# EAGLE design PATA Breakout 2 (EAGLE 9.3.1)
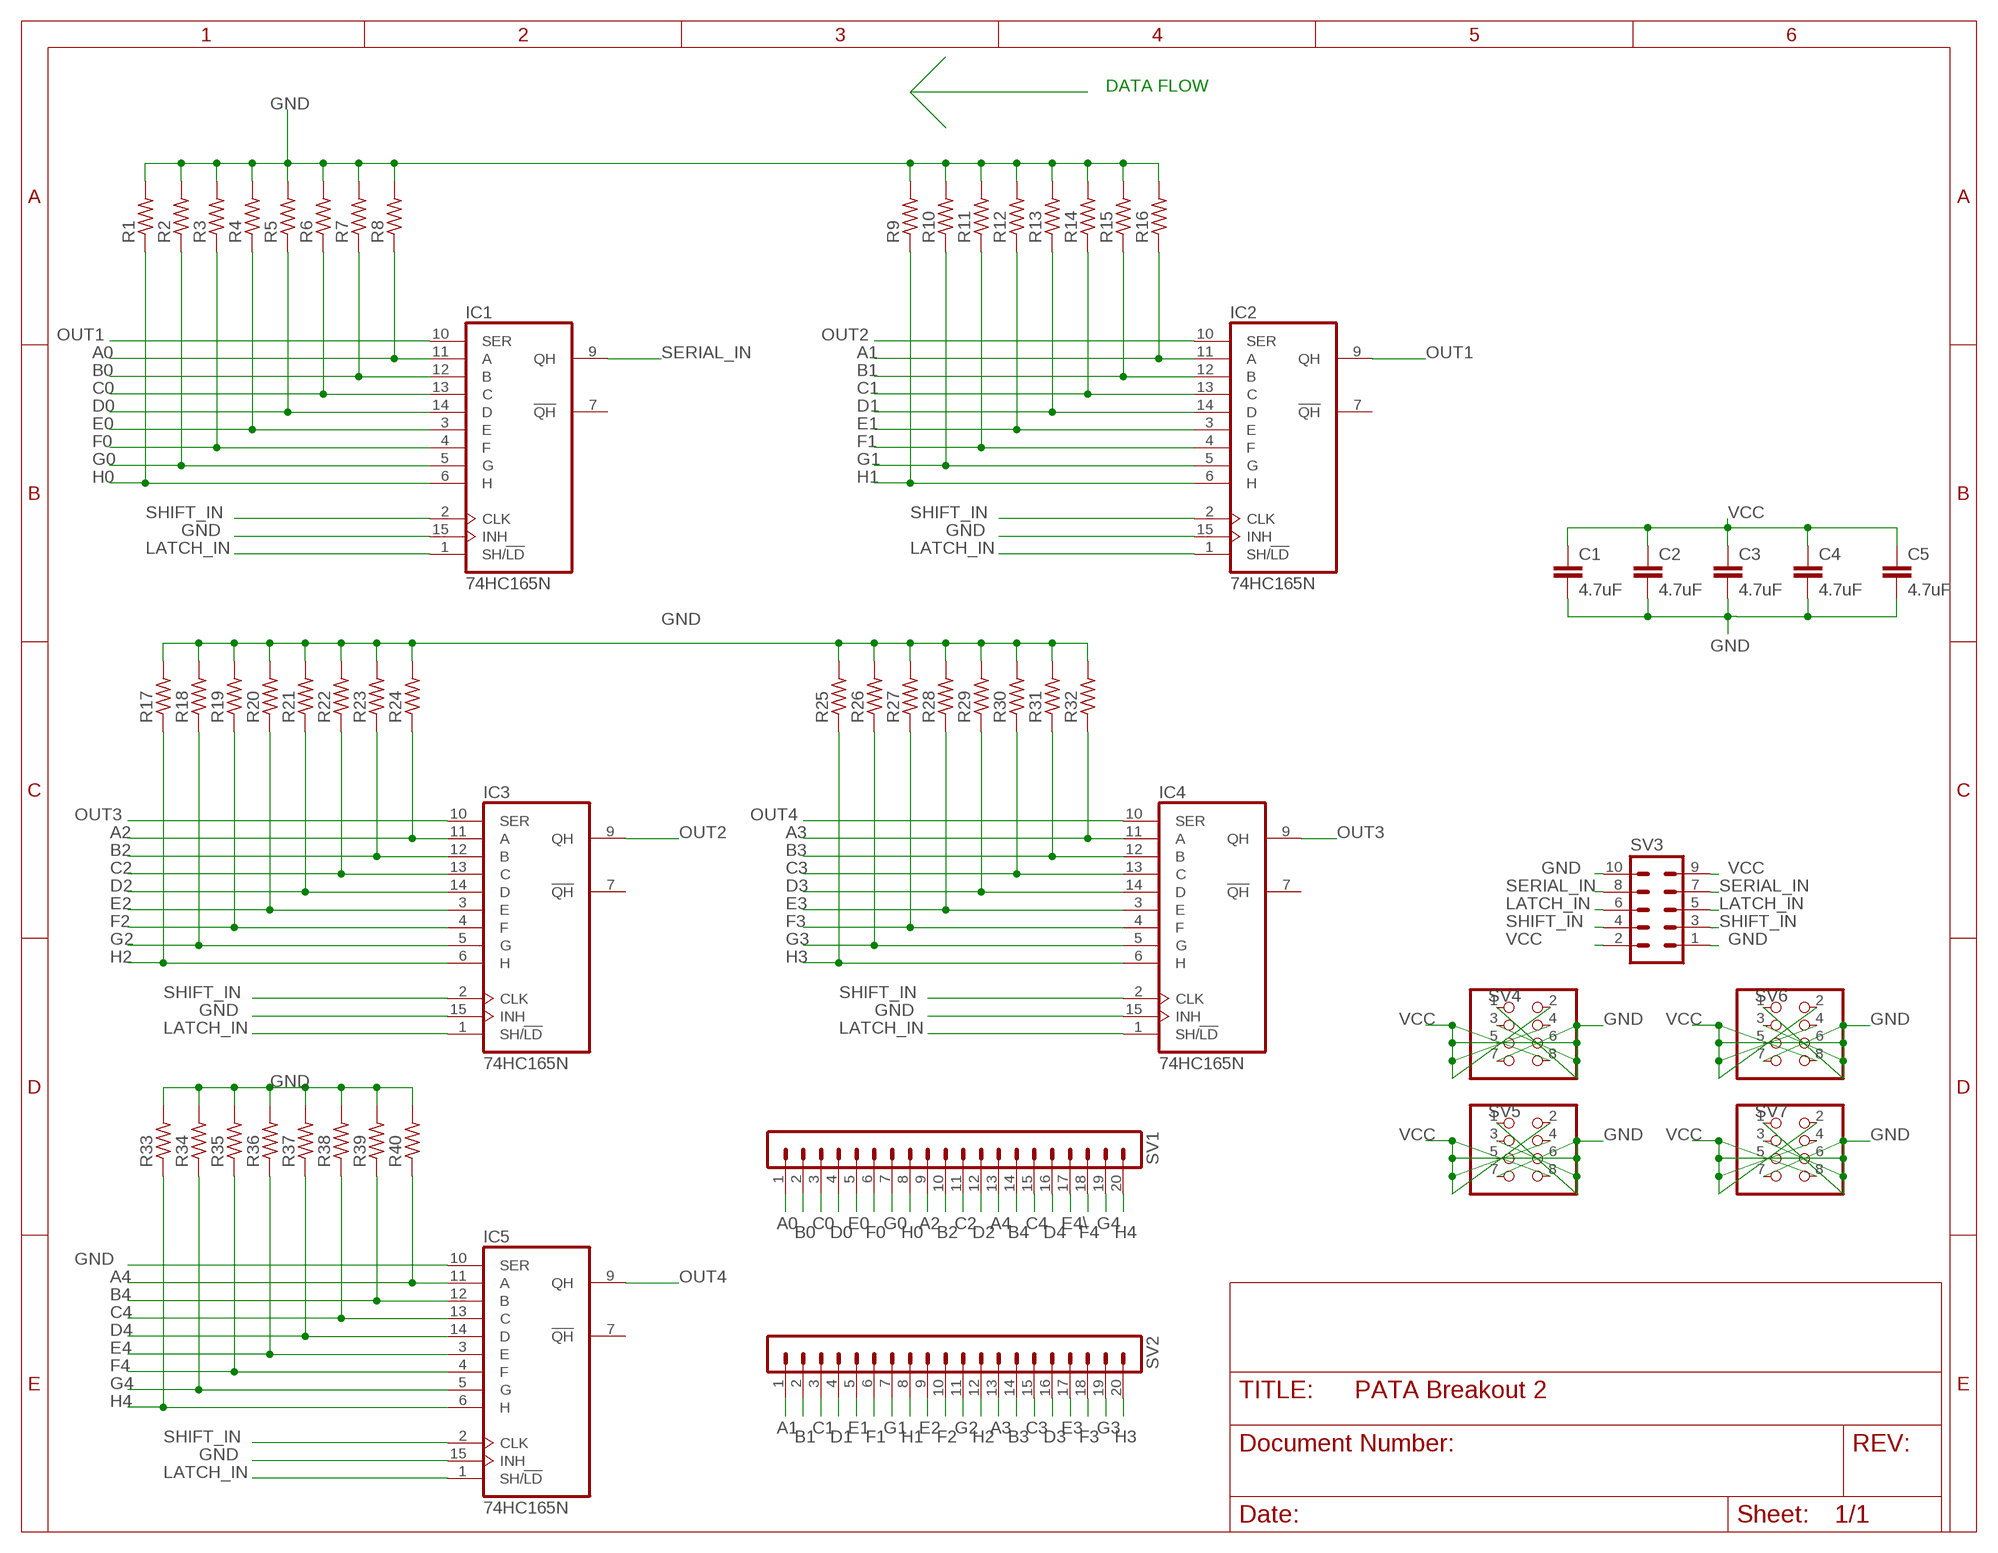
[diagram p0: schematic, sheet 1]

## Parts
C1  4.7uF  C-EU050-024X044  [C050-024X044]
C2  4.7uF  C-EU050-024X044  [C050-024X044]
C3  4.7uF  C-EU050-024X044  [C050-024X044]
C4  4.7uF  C-EU050-024X044  [C050-024X044]
C5  4.7uF  C-EU050-024X044  [C050-024X044]
IC1  74HC165N  [DIL16]
IC2  74HC165N  [DIL16]
IC3  74HC165N  [DIL16]
IC4  74HC165N  [DIL16]
IC5  74HC165N  [DIL16]
R1  R-US_0204/5  [0204/5]
R2  R-US_0204/5  [0204/5]
R3  R-US_0204/5  [0204/5]
R4  R-US_0204/5  [0204/5]
R5  R-US_0204/5  [0204/5]
R6  R-US_0204/5  [0204/5]
R7  R-US_0204/5  [0204/5]
R8  R-US_0204/5  [0204/5]
R9  R-US_0204/5  [0204/5]
R10  R-US_0204/5  [0204/5]
R11  R-US_0204/5  [0204/5]
R12  R-US_0204/5  [0204/5]
R13  R-US_0204/5  [0204/5]
R14  R-US_0204/5  [0204/5]
R15  R-US_0204/5  [0204/5]
R16  R-US_0204/5  [0204/5]
R17  R-US_0204/5  [0204/5]
R18  R-US_0204/5  [0204/5]
R19  R-US_0204/5  [0204/5]
R20  R-US_0204/5  [0204/5]
R21  R-US_0204/5  [0204/5]
R22  R-US_0204/5  [0204/5]
R23  R-US_0204/5  [0204/5]
R24  R-US_0204/5  [0204/5]
R25  R-US_0204/5  [0204/5]
R26  R-US_0204/5  [0204/5]
R27  R-US_0204/5  [0204/5]
R28  R-US_0204/5  [0204/5]
R29  R-US_0204/5  [0204/5]
R30  R-US_0204/5  [0204/5]
R31  R-US_0204/5  [0204/5]
R32  R-US_0204/5  [0204/5]
R33  R-US_0204/5  [0204/5]
R34  R-US_0204/5  [0204/5]
R35  R-US_0204/5  [0204/5]
R36  R-US_0204/5  [0204/5]
R37  R-US_0204/5  [0204/5]
R38  R-US_0204/5  [0204/5]
R39  R-US_0204/5  [0204/5]
R40  R-US_0204/5  [0204/5]
SV1  MA20-1  [MA20-1]
SV2  MA20-1  [MA20-1]
SV3  MA05-2  [MA05-2]
SV4  PINHD-2X4  [2X04]
SV5  PINHD-2X4  [2X04]
SV6  PINHD-2X4  [2X04]
SV7  PINHD-2X4  [2X04]

## Nets
A0: IC1.11(A) R8.1 SV1.1
A1: IC2.11(A) R16.1 SV2.1
A2: IC3.11(A) R24.1 SV1.9
A3: IC4.11(A) R32.1 SV2.13
A4: IC5.11(A) R40.1 SV1.13
B0: IC1.12(B) R7.1 SV1.2
B1: IC2.12(B) R15.1 SV2.2
B2: IC3.12(B) R23.1 SV1.10
B3: IC4.12(B) R31.1 SV2.14
B4: IC5.12(B) R39.1 SV1.14
C0: IC1.13(C) R6.1 SV1.3
C1: IC2.13(C) R14.1 SV2.3
C2: IC3.13(C) R22.1 SV1.11
C3: IC4.13(C) R30.1 SV2.15
C4: IC5.13(C) R38.1 SV1.15
D0: IC1.14(D) R5.1 SV1.4
D1: IC2.14(D) R13.1 SV2.4
D2: IC3.14(D) R21.1 SV1.12
D3: IC4.14(D) R29.1 SV2.16
D4: IC5.14(D) R37.1 SV1.16
E0: IC1.3(E) R4.1 SV1.5
E1: IC2.3(E) R12.1 SV2.5
E2: IC3.3(E) R20.1 SV2.9
E3: IC4.3(E) R28.1 SV2.17
E4: IC5.3(E) R36.1
E4\: SV1.17
F0: IC1.4(F) R3.1 SV1.6
F1: IC2.4(F) R11.1 SV2.6
F2: IC3.4(F) R19.1 SV2.10
F3: IC4.4(F) R27.1 SV2.18
F4: IC5.4(F) R35.1 SV1.18
G0: IC1.5(G) R2.1 SV1.7
G1: IC2.5(G) R10.1 SV2.7
G2: IC3.5(G) R18.1 SV2.11
G3: IC4.5(G) R26.1 SV2.19
G4: IC5.5(G) R34.1 SV1.19
GND: C1.2 C2.2 C3.2 C4.2 C5.2 IC1.15(INH) IC2.15(INH) IC3.15(INH) IC4.15(INH) IC5.10(SER) IC5.15(INH) R1.2 R2.2 R3.2 R4.2 R5.2 R6.2 R7.2 R8.2 R9.2 R10.2 R11.2 R12.2 R13.2 R14.2 R15.2 R16.2 R17.2 R18.2 R19.2 R20.2 R21.2 R22.2 R23.2 R24.2 R25.2 R26.2 R27.2 R28.2 R29.2 R30.2 R31.2 R32.2 R33.2 R34.2 R35.2 R36.2 R37.2 R38.2 R39.2 R40.2 SV3.1 SV3.10 SV4.1 SV4.3 SV4.5 SV4.7 SV5.1 SV5.3 SV5.5 SV5.7 SV6.1 SV6.3 SV6.5 SV6.7 SV7.1 SV7.3 SV7.5 SV7.7
H0: IC1.6(H) R1.1 SV1.8
H1: IC2.6(H) R9.1 SV2.8
H2: IC3.6(H) R17.1 SV2.12
H3: IC4.6(H) R25.1 SV2.20
H4: IC5.6(H) R33.1 SV1.20
LATCH_IN: IC1.1(SH/!LD) IC2.1(SH/!LD) IC3.1(SH/!LD) IC4.1(SH/!LD) IC5.1(SH/!LD) SV3.5 SV3.6
OUT1: IC1.10(SER) IC2.9(QH)
OUT2: IC2.10(SER) IC3.9(QH)
OUT3: IC3.10(SER) IC4.9(QH)
OUT4: IC4.10(SER) IC5.9(QH)
SERIAL_IN: IC1.9(QH) SV3.7 SV3.8
SHIFT_IN: IC1.2(CLK) IC2.2(CLK) IC3.2(CLK) IC4.2(CLK) IC5.2(CLK) SV3.3 SV3.4
VCC: C1.1 C2.1 C3.1 C4.1 C5.1 SV3.2 SV3.9 SV4.2 SV4.4 SV4.6 SV4.8 SV5.2 SV5.4 SV5.6 SV5.8 SV6.2 SV6.4 SV6.6 SV6.8 SV7.2 SV7.4 SV7.6 SV7.8
Unconnected: IC1.7(!QH) IC2.7(!QH) IC3.7(!QH) IC4.7(!QH) IC5.7(!QH)

## Notes on the sheet
- DATA FLOW

## Power pins joined to a net without a drawn wire
GND: IC1.8(GND) IC2.8(GND) IC3.8(GND) IC4.8(GND) IC5.8(GND)
VCC: IC1.16(VCC) IC2.16(VCC) IC3.16(VCC) IC4.16(VCC) IC5.16(VCC)

## Library data of the parts
C1-C5 = rcl:C-EU: CAPACITOR, European symbol; SPICEPREFIX: C
IC1-IC5 = 74xx-eu:74*165: 8-bit parallel load SHIFT REGISTER
R1-R40 = rcl:R-US_: RESISTOR, American symbol; SPICEPREFIX: R
SV1 SV2 = con-lstb:MA20-1: PIN HEADER; OC_FARNELL: unknown; OC_NEWARK: unknown
SV3 = con-lstb:MA05-2: PIN HEADER; OC_FARNELL: unknown; OC_NEWARK: unknown
SV4-SV7 = pinhead:PINHD-2X4: PIN HEADER

## Board
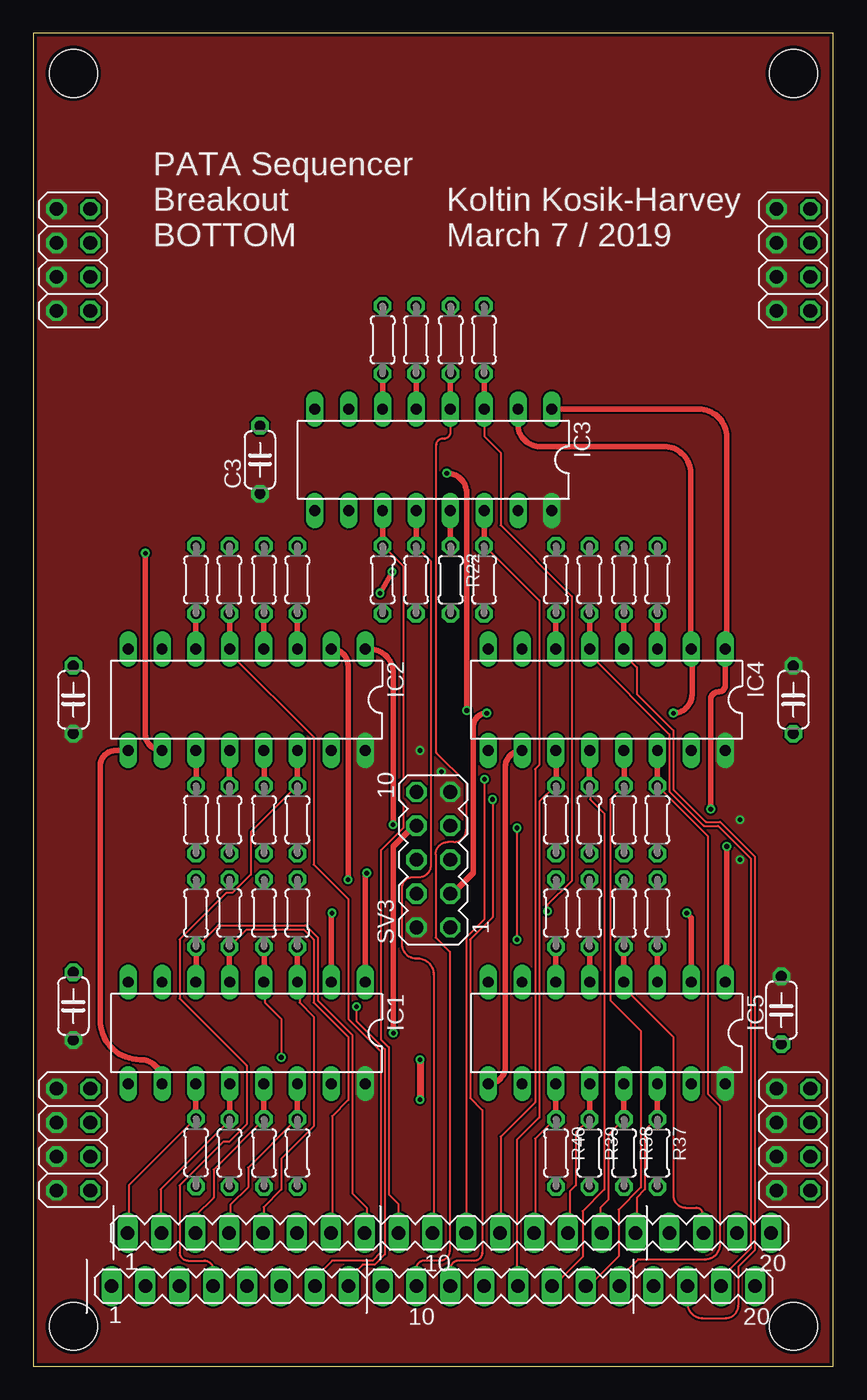
[diagram p1: board, top side]
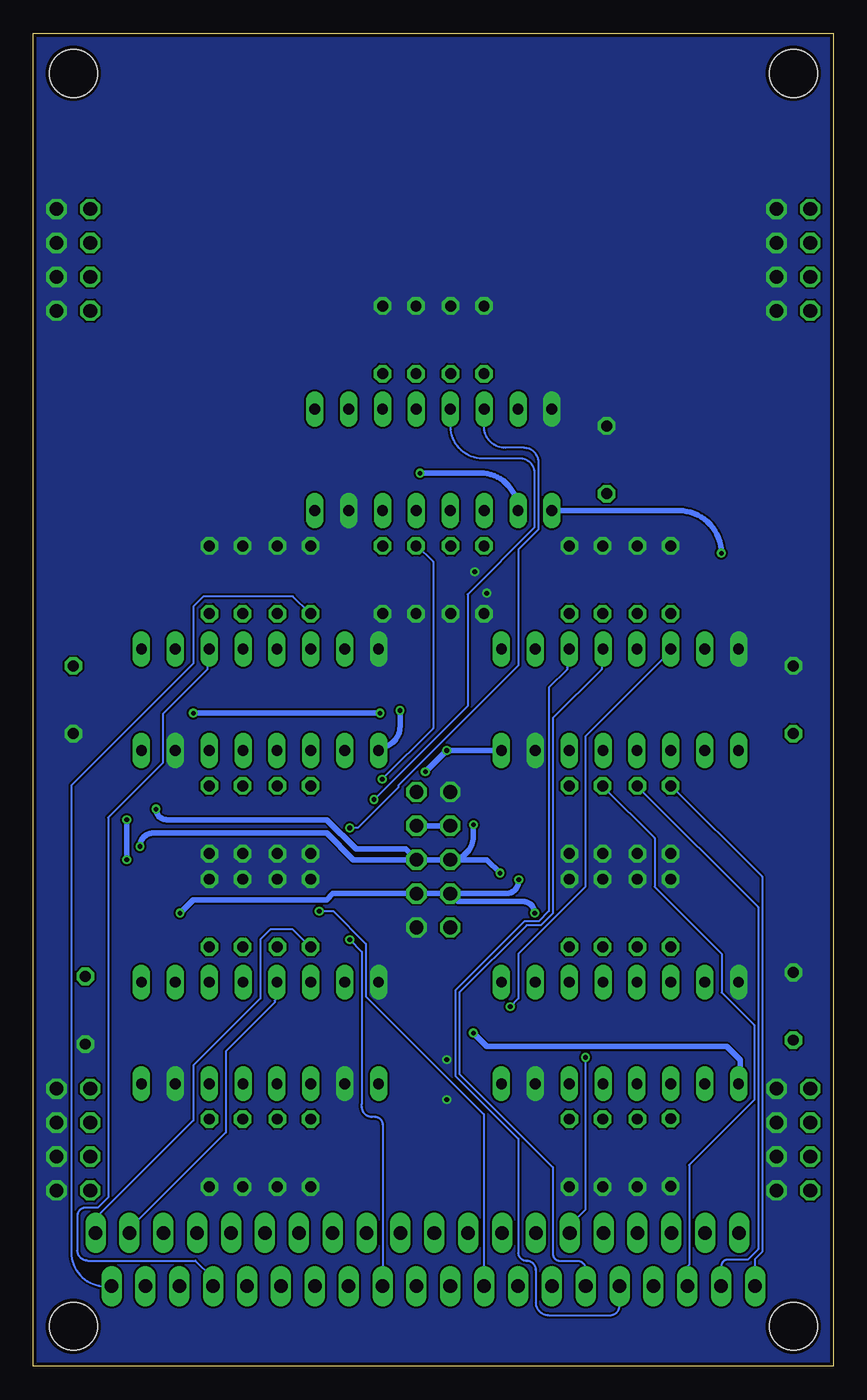
[diagram p2: board, bottom side, seen from below]

Size 60 x 100 mm. Coordinates in mm from the lower left corner, seen from the top.
Outline: 0,0 60,0 60,100 0,100 0,0
Copper layers (1*16): Top 0.035mm / dielectric 1.5mm / Bottom 0.035mm
Design rules "SeeedStudio_2layer_DRU_no_angle_20140221": minimum track width 6mil, minimum drill 12mil, track to track 6mil, track to pad 6mil, pad to pad 6mil, via to via 6mil, smd to smd 0mil, copper to edge 10mil, drill to drill 10mil, minimum pad ring 10mil, minimum via ring 6mil, stop-mask expansion 2mil, vias tented up to drill 100mil, thermal gap 10mil
Holes 3.6 mm at 3,3 57,3 3,97 57,97

### Footprints (pad centres in the part's own frame; a part is rotated, then mirrored left to right if it is on the bottom)
C050-024X044 = drill 0.813 octagon: 1 -2.54,0; 2 2.54,0
DIL16 = drill 0.813 long: 1 -8.89,-3.81; 2 -6.35,-3.81; 3 -3.81,-3.81; 4 -1.27,-3.81; 5 1.27,-3.81; 6 3.81,-3.81; 7 6.35,-3.81; 8 8.89,-3.81; 9 8.89,3.81; 10 6.35,3.81; 11 3.81,3.81; 12 1.27,3.81; 13 -1.27,3.81; 14 -3.81,3.81; 15 -6.35,3.81; 16 -8.89,3.81
0204/5 = drill 0.813 octagon: 1 -2.54,0; 2 2.54,0
MA20-1 = drill 1.016 long: 1 -24.13,0; 2 -21.59,0; 3 -19.05,0; 4 -16.51,0; 5 -13.97,0; 6 -11.43,0; 7 -8.89,0; 8 -6.35,0; 9 -3.81,0; 10 -1.27,0; 11 1.27,0; 12 3.81,0; 13 6.35,0; 14 8.89,0; 15 11.43,0; 16 13.97,0; 17 16.51,0; 18 19.05,0; 19 21.59,0; 20 24.13,0
MA05-2 = drill 1.016 octagon: 1 -5.08,-1.27; 2 -5.08,1.27; 3 -2.54,-1.27; 4 -2.54,1.27; 5 0,-1.27; 6 0,1.27; 7 2.54,-1.27; 8 2.54,1.27; 9 5.08,-1.27; 10 5.08,1.27
2X04 = drill 1.016 octagon: 1 -3.81,-1.27; 2 -3.81,1.27; 3 -1.27,-1.27; 4 -1.27,1.27; 5 1.27,-1.27; 6 1.27,1.27; 7 3.81,-1.27; 8 3.81,1.27

### Placement (x,y rotation side)
C1  3,27 90 top
C2  3,50 90 top
C3  17,68 90 top
C4  57,50 270 top
C5  56.1,26.7 270 top
IC1  16,25 180 top
IC2  16,50 180 top
IC3  30,68 180 top
IC4  43,50 180 top
IC5  43,25 180 top
R1  12.2,34 90 top
R2  14.7,34 90 top
R3  17.3,34 90 top
R4  19.8,34 90 top
R5  19.8,16 270 top
R6  17.3,16 270 top
R7  14.7,16 270 top
R8  12.2,16.03 270 top
R9  12.2,59 90 top
R10  14.7,59 90 top
R11  17.3,59 90 top
R12  19.8,59 90 top
R13  19.8,41 270 top
R14  17.3,41 270 top
R15  14.7,41 270 top
R16  12.2,41 270 top
R17  26.2,77 90 top
R18  28.7,77 90 top
R19  31.3,77 90 top
R20  33.8,77 90 top
R21  33.8,59 270 top
R22  31.3,59 270 top
R23  28.7,59 270 top
R24  26.2,59 270 top
R25  39.2,59 90 top
R26  41.7,59 90 top
R27  44.3,59 90 top
R28  46.8,59 90 top
R29  46.8,41 270 top
R30  44.3,41 270 top
R31  41.7,41 270 top
R32  39.2,41 270 top
R33  39.2,34 90 top
R34  41.7,34 90 top
R35  44.3,34 90 top
R36  46.8,34 90 top
R37  46.8,16 270 top
R38  44.3,16 270 top
R39  41.7,16 270 top
R40  39.2,16 270 top
SV1  31.2,10 0 top
SV2  30,6 0 top
SV3  30,38 90 top
SV4  3,17 90 top
SV5  3,83 90 top
SV6  57,83 90 top
SV7  57,17 90 top

### Tracks (layer width: path | path; a pad name or v marks a point on that pad's centre or on a via)
A0
  Top 0.152: SV1.1 7.16,10.06 7.16,13.56 12.19,18.59 R8.1
  Top 0.406: IC1.11 R8.1
A1
  Top 0.406: R16.1 IC2.11
  Bottom 0.152: SV2.1 5.89,6.02 5.89,8.01 5.33,8.56 5.33,36.73 12.19,43.59 R16.1
A2
  Top 0.152: SV1.9 27.38,12.18 26.67,12.89 26.67,23.93 26.06,24.54 26.06,38.71 27.74,40.39 27.74,42.22 27.43,42.52 27.43,43.74 27.74,44.04 27.74,60.05 26.21,61.57 R24.1
  Top 0.406: IC3.11 R24.1
A3
  Top 0.152: SV2.13 36.27,6.1 36.27,16.98 37.95,18.66 37.95,42.37 39.17,43.59 R32.1
  Top 0.406: R32.1 IC4.11
A4
  Top 0.152: SV1.13 37.64,10.06 37.64,17.07 39.01,18.44 R40.1
  Top 0.406: IC5.11 R40.1
B0
  Top 0.152: SV1.2 9.55,10.06 9.55,13.26 14.4,18.11 R7.1
  Top 0.406: IC1.12 14.73,18.57 R7.1
B1
  Top 0.406: R15.1 14.7,46.16 IC2.12
  Bottom 0.152: SV2.2 SV2.2 arc-90 8.4,6.03 8.4,7.5 arc90 7.9,8 6.43,8 5.64,8.79 5.64,34.44 14.63,43.43 R15.1
B2
  Top 0.152: SV1.10 30.02,10.06 30.02,29.38 arc90 28.8,30.6 28.7,30.6 arc-90 27.64,31.66 27.64,35.87 arc-90 28.45,36.68 28.91,36.68 arc90 29.82,37.59 29.82,60.4 28.8,61.42 R23.1
  Top 0.406: IC3.12 28.73,61.57 R23.1
B3
  Top 0.152: SV2.14 39.01,6 41.2,8.19 41.2,11.63 42.82,13.26 42.82,41.45 41.76,42.52 41.76,43.43 R31.1
  Top 0.406: R31.1 41.7,46.16 IC4.12
B4
  Top 0.152: SV1.14 40.23,10.06 40.23,13.11 40.69,13.56 40.69,17.53 41.6,18.44 R39.1
  Top 0.406: IC5.12 41.73,18.57 R39.1
C0
  Top 0.152: SV1.3 12.19,10.06 12.19,11.32 13.52,12.65 13.52,14.73 17.22,18.44 R6.1
  Top 0.406: IC1.13 17.27,18.57 R6.1
C1
  Top 0.406: R14.1 17.3,46.16 IC2.13
  Bottom 0.152: SV2.3 10.97,6.1 10.97,7.47 10.82,7.62 10.82,15.09 5.94,19.96 5.94,25.6 8.38,28.04 8.38,30.94 13.41,35.97 13.41,39.62 17.22,43.43 R14.1
C2  (via drill 0.35)
  Top 0.152: SV1.11 32.46,32.16 33.83,33.53 v33.83,44.04
  Top 0.406: IC3.13 31.27,61.57 R22.1
  Bottom 0.152: v33.83,44.04 30.02,47.85 30.02,60.35 31.24,61.57 R22.1
C3
  Top 0.152: SV2.15 41.66,6 43.89,8.23 43.89,11.73 45.57,13.41 45.57,25.15 43.28,27.43 43.28,42.52 44.2,43.43 R30.1
  Top 0.406: R30.1 44.3,46.16 IC4.13
C4
  Top 0.152: SV1.15 42.52,10.06 42.52,11.89 43.13,12.5 43.13,17.37 44.2,18.44 R38.1
  Top 0.406: IC5.13 44.27,18.57 R38.1
D0
  Top 0.152: SV1.4 14.78,10.06 14.78,12.09 16.11,13.42 16.11,14.89 19.66,18.44 R5.1
  Top 0.406: IC1.14 R5.1
D1
  Top 0.152: R13.1 19.66,43.43 16.31,40.08 16.31,36.88 14.94,35.51 14.48,35.51 10.97,32 10.97,27.58 16,22.55 16,18.14 14.69,16.82 14.23,16.82 10.97,13.56 10.97,8.53 arc90 11.58,7.92 12.79,7.92 arc-90 13.51,7.21 13.51,6.1 SV2.4
  Top 0.406: R13.1 IC2.14
D2
  Top 0.152: SV1.12 35.05,10.06 35.05,17.22 37.64,19.81 37.64,44.81 37.95,45.11 37.95,57.45 33.83,61.57 R21.1
  Top 0.406: IC3.14 R21.1
D3
  Top 0.152: SV2.16 44.04,6.1 44.04,6.71 45.36,8.03 50.39,8.03 arc90 51.51,9.14 51.51,19.51 50.6,20.42 50.6,39.78 46.94,43.43 R29.1
  Top 0.406: R29.1 IC4.14
D4
  Top 0.152: SV1.16 45.26,10.06 45.26,12.65 45.87,13.26 45.87,17.68 46.63,18.44 R37.1
  Top 0.406: IC5.14 R37.1
E0
  Top 0.152: SV1.5 17.27,10.02 17.27,11.94 18.6,13.26 18.6,15.55 21.03,17.98 21.03,26.21 19.96,27.28 19.96,28.8 IC1.3
  Top 0.406: R4.1 IC1.3
E1
  Top 0.406: IC2.3 R12.1
  Bottom 0.152: IC2.3 19.81,53.8 19.81,52.58 19.96,52.43 19.96,52.27 21.34,50.9 21.34,34.14 22.1,33.38 23.16,33.38 28.35,28.19 28.35,21.79 23.62,17.07 23.62,8.52 arc-90 23,7.9 arc90 22.3,7.2 22.3,4.77 arc-90 21.34,3.81 16.78,3.81 arc-90 16.03,4.56 SV2.5
E2  (via drill 0.35)
  Top 0.152: v38.56,34.14 38.56,34.59 40.39,36.42 40.39,57.76 35.05,63.09 35.05,68.55 33.83,69.77 33.83,71.63 IC3.3
  Top 0.406: IC3.3 R20.1
  Bottom 0.152: v38.56,34.14 37.49,34.14 35.05,31.7 35.05,27.74 26.21,18.9 26.21,6.1 SV2.9
E3
  Top 0.406: IC4.3 R28.1
  Bottom 0.152: SV2.17 46.63,6.1 46.63,6.71 47.85,7.92 55.93,7.92 arc90 56.69,8.69 56.69,11.28 arc90 56.07,11.9 55.16,11.9 54.39,12.67 54.39,41.17 50.29,45.26 50.29,48.92 46.94,52.27 46.94,53.8 IC4.3
E4
  Top 0.406: IC5.3 R36.1
F0  (via drill 0.35)
  Top 0.152: v18.59,23.16 18.59,26.06 17.37,27.28 17.37,28.65 IC1.4
  Top 0.406: R3.1 17.3,28.84 IC1.4
  Bottom 0.152: v18.59,23.16 18.59,11.73 19.66,10.67 19.66,10.06 SV1.6
F1
  Top 0.406: IC2.4 17.27,56.43 R11.1
  Bottom 0.152: IC2.4 17.37,53.8 17.37,52.27 21.03,48.62 21.03,33.98 21.95,33.07 23.01,33.07 28.04,28.04 28.04,21.95 21.03,14.94 21.03,8.43 arc-90 20.5,7.9 19.2,7.9 arc90 18.57,7.27 SV2.6
F2
  Top 0.152: IC3.4 arc-90 31.3,71.78 31.3,70.1 arc-90 30.8,69.6 30.7,69.6 arc90 30.22,69.12 30.22,46.02 32.46,43.79 32.46,40.23 arc-90 31.55,39.32 31.09,39.32 arc90 30.18,38.41 30.18,32.16 31.24,31.09 31.24,8.69 arc-90 30.48,7.92 29.32,7.92 arc90 28.73,7.33 SV2.10
  Top 0.406: IC3.4 31.27,74.43 R19.1
F3
  Top 0.152: IC4.4 44.35,53.65 44.35,53.34 45.26,52.43 45.26,50.44 48.01,47.7 48.01,43.28 50.44,40.84 51.51,40.84 54.1,38.25 54.1,8.69 52.88,7.47 52.88,4.57 arc-90 51.91,3.6 50.2,3.6 arc-90 49.05,4.75 SV2.18
  Top 0.406: IC4.4 44.27,56.43 R27.1
F4
  Top 0.152: IC5.4 44.35,28.65 44.35,28.35 48.01,24.69 48.01,12.79 arc90 48.9,11.9 49.7,11.9 arc-90 50.2,11.4 50.2,10.05 arc90 SV1.18
  Top 0.406: IC5.4 44.27,31.43 R35.1
G0
  Top 0.152: SV1.7 22.4,10.06 22.4,18.75 23.62,19.96 23.62,24.69 21.03,27.28 21.03,32 20.27,32.77 16,32.77 14.78,31.55 R2.1
  Top 0.406: R2.1 14.7,28.84 IC1.5
G1
  Top 0.152: SV2.7 21.18,6.1 21.18,6.71 22.4,7.92 25.45,7.92 26.06,8.53 26.06,23.62 23.62,26.06 23.62,35.05 21.03,37.64 21.03,47.19 14.78,53.44 14.78,53.65 IC2.5
  Top 0.406: IC2.5 14.73,56.43 R10.1
G2  (via drill 0.35)
  Top 0.152: v34.44,42.52 34.44,33.68 32.77,32 32.77,20.12 33.68,19.2 33.68,8.53 arc-90 33.07,7.92 31.91,7.92 arc90 31.27,7.28 SV2.11
  Top 0.406: IC3.5 28.73,74.43 R18.1
  Bottom 0.152: v34.44,42.52 27.43,49.53 27.43,57.91 22.4,62.94 22.4,67 arc-90 23.5,68.1 26.3,68.1 arc90 28.7,70.5 28.7,71.78 arc-90 IC3.5
G3
  Top 0.152: SV2.19 51.66,6.1 51.66,6.71 53.8,8.84 53.8,38.1 51.36,40.54 50.29,40.54 47.7,43.13 47.7,47.4 41.76,53.34 41.76,53.65 IC4.5
  Top 0.406: IC4.5 41.73,56.43 R26.1
G4
  Top 0.406: IC5.5 41.73,31.43 R34.1
  Bottom 0.152: SV1.19 52.73,10.06 52.73,10.36 45.57,17.53 45.57,23.62 41.91,27.28 41.91,27.43 41.76,27.58 41.76,28.8 IC5.5
GND  (via drill 0.35)
  Top 0.406: v26.9,59.6 v26,58
  Top 0.508: v29,23 v29,20
  pour Bottom (no thermals): -2,102 62,102 62,-1 62,-2 -2,-2
H0
  Top 0.152: SV1.8 24.99,10.06 24.99,11.89 23.93,12.95 23.93,24.84 21.34,27.43 21.34,32.16 20.42,33.07 13.87,33.07 12.34,31.55 R1.1
  Top 0.406: R1.1 IC1.6
H1  (via drill 0.35)
  Top 0.152: v24.23,26.98 24.23,25.91 26.36,23.77 26.36,8.38 25.6,7.62 24.69,7.62 23.77,6.71 23.77,6.1 SV2.8
  Top 0.406: IC2.6 R9.1
  Bottom 0.152: v24.23,26.98 23.62,27.58 23.62,30.94 18.59,35.97 18.59,47.24 12.19,53.65 12.19,53.8 IC2.6
H2  (via drill 0.35)
  Top 0.152: v36.27,40.39 v36.27,32
  Top 0.406: IC3.6 R17.1
  Bottom 0.152: SV2.12 33.78,6.02 33.78,18.09 arc-90 34.39,18.7 34.6,18.7 arc90 35.36,19.46 35.36,19.66 35.36,19.7 35.36,31.09 v36.27,32 | v36.27,40.39 35.66,40.39 32.61,43.43 32.61,43.59 23.62,52.58 23.62,61.27 22.1,62.79 22.1,67.8 arc-90 23.2,68.9 24.6,68.9 arc90 26.2,70.5 IC3.6 arc90 IC3.6
H3
  Top 0.406: IC4.6 R25.1
  Bottom 0.152: R25.1 39.32,56.54 40.54,57.76 47.24,57.76 48.01,57 48.01,52.73 57.15,43.59 57.15,17 57.15,8.53 arc-90 54.62,6 SV2.20
H4
  Top 0.406: IC5.6 R33.1
  Bottom 0.152: SV1.20 55.32,10.06 55.32,11.12 48.01,18.44 48.01,22.55 42.98,27.58 42.98,32 42.22,32.77 40.54,32.77 39.32,31.55 R33.1
LATCH_IN  (via drill 0.35)
  Top 0.406: v25,37 24.89,36.89 IC1.1 | v52,39 52,28.92 IC5.1 | v50.8,41.8 50.8,50 arc-90 51.4,50.6 arc90 51.9,51.1 51.9,51.8 arc90 51.89,51.81 IC4.1 arc90 52,53.92 52,69.7 arc90 49.9,71.8 IC3.1 | v26.98,40.62 arc90 27,40.64 27,52 arc90 25.19,53.81 IC2.1
  Bottom 0.406: SV3.6 SV3.5 | SV3.6 26,38 v25,37 | SV3.5 36,38 38,40 51,40 arc-90 v52,39 | SV3.5 32.07,38.8 35.8,38.8 38,41 50,41 arc90 v50.8,41.8 | SV3.6 arc-90 27,39.73 27,40.6 arc-90 v26.98,40.62
OUT1
  Top 0.406: IC2.9 6.19,46.19 arc90 5,45 5,26 arc90 8,23 arc-90 9.65,21.35 IC1.10
OUT2  (via drill 0.35)
  Top 0.406: v8.4,61 8.4,47.44 arc90 IC2.10
  Bottom 0.406: IC3.9 11.59,64.19 arc90 v8.4,61
OUT3  (via drill 0.35)
  Top 0.406: v32.5,49.2 32.5,65.5 arc90 v31,67
  Bottom 0.406: IC4.9 34.11,46.39 arc-90 32.5,48 v32.5,49.2 | v31,67 26.46,67 arc90 IC3.10
OUT4
  Top 0.406: IC5.9 arc90 35.4,22.48 35.4,44.94 arc-90 IC4.10
SERIAL_IN  (via drill 0.35)
  Top 0.406: v27,25 27,39 28.54,40.54 SV3.8
  Bottom 0.406: SV3.8 SV3.7 | IC1.9 7,21.3 7,23 8,24 26,24 v27,25
SHIFT_IN  (via drill 0.35)
  Top 0.406: v49,34 49.35,33.65 IC5.2 | v22.4,34 22.35,33.95 IC1.2 | SV3.3 31.46,35.46 33,37 33,48 arc-90 v34,49 | v48,49 arc90 49.4,50.4 49.4,53.76 IC4.2 arc-90 49.3,53.86 49.3,67 arc90 47.3,69 38,69 arc-90 36.35,70.65 IC3.2 | IC2.2 arc-90 23.6,52.56 v23.6,36.5
  Bottom 0.406: SV3.4 SV3.3 37.54,35.46 38,35 48,35 v49,34 | SV3.4 28.13,34.86 23.26,34.86 arc90 v22.4,34 | SV3.4 24.54,35.46 arc-90 23.6,36.4 v23.6,36.5 | v34,49 v48,49
VCC  (via drill 0.35)
  Bottom 0.406: v30.6,44.6 v29,46.2 v29,46.19 IC2.16 | v53,41 v53,38
  pour Top (no thermals): -1,101 61,101 61,-1 -1,-1

### Text on the board
tPlace: PATA Sequencer / Breakout / BOTTOM | Koltin Kosik-Harvey / March 7 / 2019